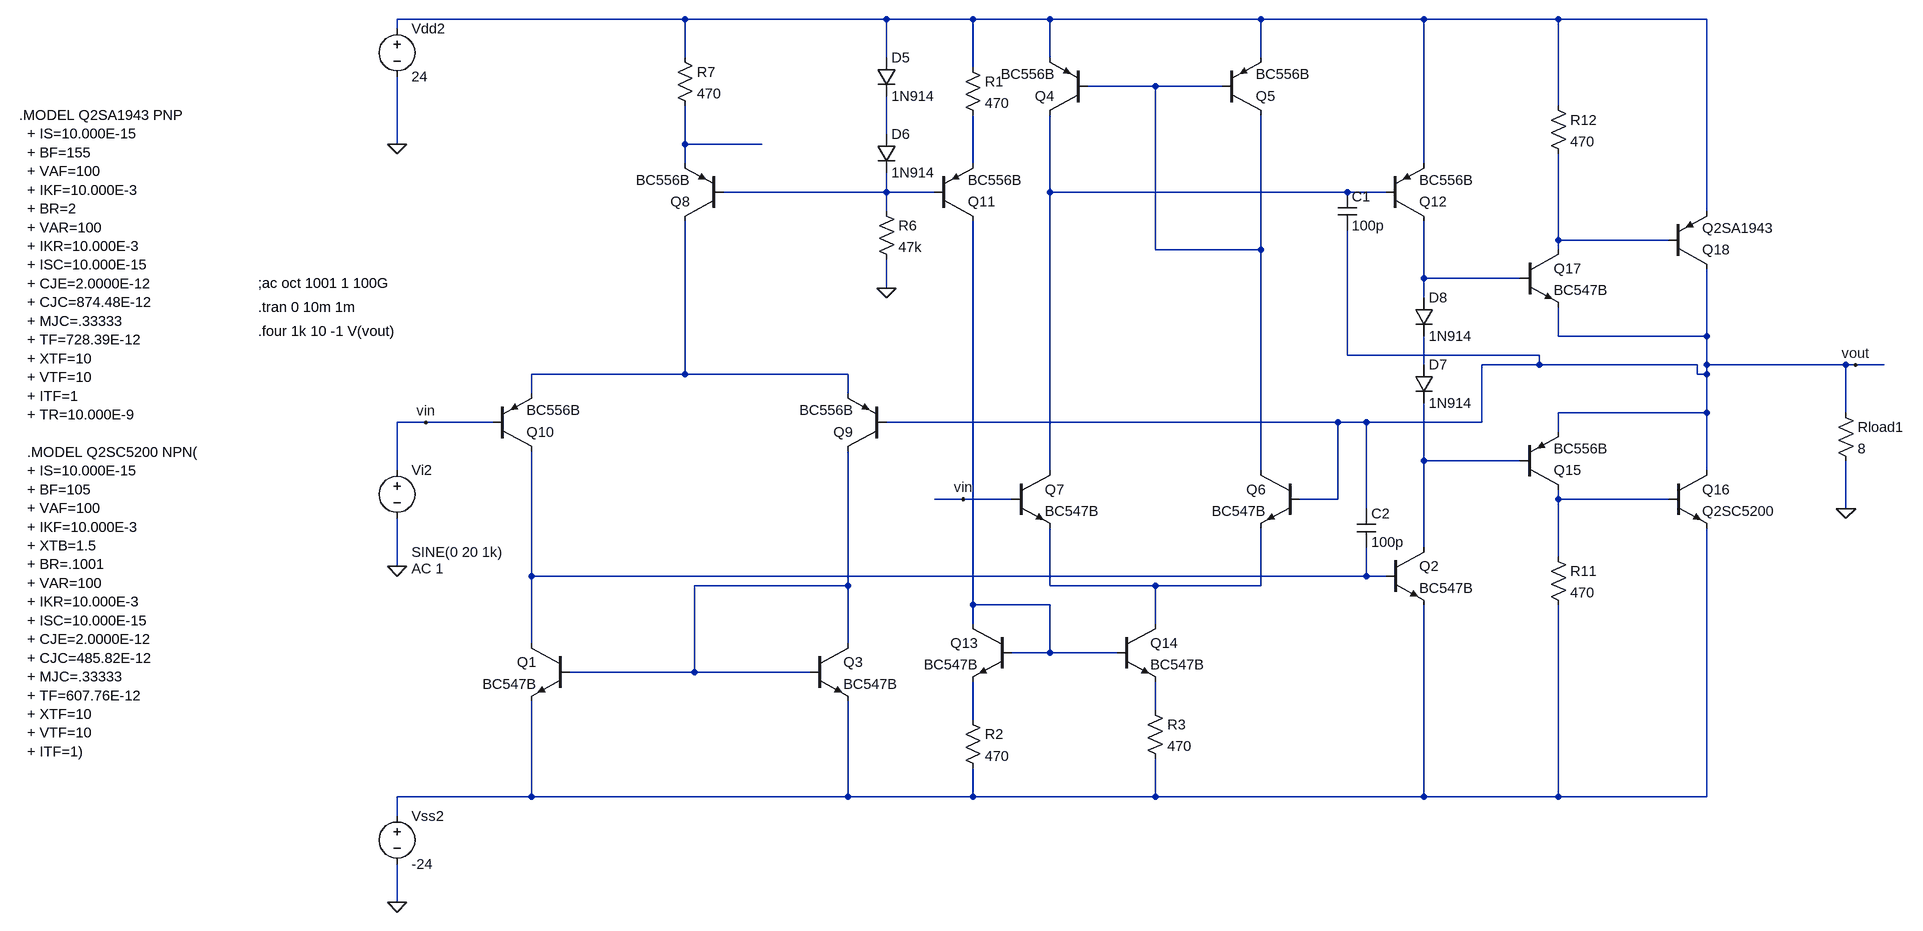
[diagram p0: schematic rail-to-rail-input-pair-amp.asc]
rail-to-rail-input-pair-amp.asc, the LTspice schematic file:
Version 4
SHEET 1 4780 1364
WIRE 2496 -128 2016 -128
WIRE 2832 -128 2496 -128
WIRE 2976 -128 2832 -128
WIRE 3104 -128 2976 -128
WIRE 3456 -128 3104 -128
WIRE 3728 -128 3456 -128
WIRE 3952 -128 3728 -128
WIRE 4208 -128 3952 -128
WIRE 2016 -112 2016 -128
WIRE 2496 -64 2496 -128
WIRE 2832 -64 2832 -128
WIRE 3104 -64 3104 -128
WIRE 3456 -64 3456 -128
WIRE 2976 -48 2976 -128
WIRE 3280 -16 3168 -16
WIRE 3392 -16 3280 -16
WIRE 3952 16 3952 -128
WIRE 2832 64 2832 0
WIRE 2016 80 2016 -32
WIRE 2496 80 2496 16
WIRE 2624 80 2496 80
WIRE 2496 112 2496 80
WIRE 2976 112 2976 32
WIRE 3728 112 3728 -128
WIRE 2832 160 2832 128
WIRE 2832 160 2560 160
WIRE 2912 160 2832 160
WIRE 3104 160 3104 32
WIRE 3600 160 3104 160
WIRE 3664 160 3600 160
WIRE 2832 192 2832 160
WIRE 4208 192 4208 -128
WIRE 3952 240 3952 96
WIRE 4144 240 3952 240
WIRE 3280 256 3280 -16
WIRE 3456 256 3456 32
WIRE 3456 256 3280 256
WIRE 3952 256 3952 240
WIRE 3728 304 3728 208
WIRE 3888 304 3728 304
WIRE 2832 320 2832 272
WIRE 3728 336 3728 304
WIRE 3952 400 3952 352
WIRE 4208 400 4208 288
WIRE 4208 400 3952 400
WIRE 3600 432 3600 224
WIRE 3920 432 3600 432
WIRE 3728 448 3728 400
WIRE 3920 448 3920 432
WIRE 3920 448 3824 448
WIRE 4192 448 3920 448
WIRE 4208 448 4208 400
WIRE 4528 448 4208 448
WIRE 4544 448 4528 448
WIRE 4592 448 4544 448
WIRE 2496 464 2496 208
WIRE 2496 464 2240 464
WIRE 2768 464 2496 464
WIRE 4192 464 4192 448
WIRE 4208 464 4208 448
WIRE 4208 464 4192 464
WIRE 2240 496 2240 464
WIRE 2768 496 2768 464
WIRE 4208 528 4208 464
WIRE 4208 528 3952 528
WIRE 4528 528 4528 448
WIRE 2064 544 2016 544
WIRE 2176 544 2064 544
WIRE 3584 544 2832 544
WIRE 3632 544 3584 544
WIRE 3824 544 3824 448
WIRE 3824 544 3632 544
WIRE 3952 560 3952 528
WIRE 3728 608 3728 512
WIRE 3888 608 3728 608
WIRE 2016 624 2016 544
WIRE 3104 624 3104 160
WIRE 3456 624 3456 256
WIRE 4208 624 4208 528
WIRE 2960 672 2912 672
WIRE 3040 672 2960 672
WIRE 3584 672 3584 544
WIRE 3584 672 3520 672
WIRE 3952 672 3952 656
WIRE 4144 672 3952 672
WIRE 3632 688 3632 544
WIRE 4528 688 4528 608
WIRE 3728 752 3728 608
WIRE 3952 768 3952 672
WIRE 2016 784 2016 704
WIRE 2240 800 2240 592
WIRE 3632 800 3632 752
WIRE 3632 800 2240 800
WIRE 3664 800 3632 800
WIRE 2768 816 2768 592
WIRE 2768 816 2512 816
WIRE 3104 816 3104 720
WIRE 3280 816 3104 816
WIRE 3456 816 3456 720
WIRE 3456 816 3280 816
WIRE 2976 848 2976 208
WIRE 3104 848 2976 848
WIRE 2976 880 2976 848
WIRE 3280 880 3280 816
WIRE 2240 912 2240 800
WIRE 2768 912 2768 816
WIRE 3104 928 3104 848
WIRE 3104 928 3040 928
WIRE 3216 928 3104 928
WIRE 2512 960 2512 816
WIRE 2512 960 2304 960
WIRE 2704 960 2512 960
WIRE 3280 1024 3280 976
WIRE 2976 1040 2976 976
WIRE 2240 1168 2240 1008
WIRE 2240 1168 2016 1168
WIRE 2768 1168 2768 1008
WIRE 2768 1168 2240 1168
WIRE 2976 1168 2976 1120
WIRE 2976 1168 2768 1168
WIRE 3280 1168 3280 1104
WIRE 3280 1168 2976 1168
WIRE 3728 1168 3728 848
WIRE 3728 1168 3280 1168
WIRE 3952 1168 3952 848
WIRE 3952 1168 3728 1168
WIRE 4208 1168 4208 720
WIRE 4208 1168 3952 1168
WIRE 2016 1200 2016 1168
WIRE 2016 1344 2016 1280
FLAG 2016 784 0
FLAG 2064 544 vin
FLAG 2016 1344 0
FLAG 2016 80 0
FLAG 2832 320 0
FLAG 4528 688 0
FLAG 4544 448 vout
FLAG 2960 672 vin
DATAFLAG 2624 464 ""
DATAFLAG 2608 80 ""
DATAFLAG 3440 544 ""
DATAFLAG 4048 240 ""
DATAFLAG 4064 672 ""
DATAFLAG 4592 448 ""
SYMBOL diode 2816 -64 R0
SYMATTR InstName D5
SYMATTR Value 1N914
SYMBOL diode 2816 64 R0
SYMATTR InstName D6
SYMATTR Value 1N914
SYMBOL res 2816 176 R0
SYMATTR InstName R6
SYMATTR Value 47k
SYMBOL pnp 2560 208 R180
SYMATTR InstName Q8
SYMATTR Value BC556B
SYMBOL res 2480 -80 R0
SYMATTR InstName R7
SYMATTR Value 470
SYMBOL pnp 2832 592 R180
SYMATTR InstName Q9
SYMATTR Value BC556B
SYMBOL pnp 2176 592 M180
SYMATTR InstName Q10
SYMATTR Value BC556B
SYMBOL voltage 2016 1184 R0
WINDOW 123 24 124 Left 2
WINDOW 39 0 0 Left 0
SYMATTR InstName Vss2
SYMATTR Value -24
SYMBOL voltage 2016 -128 R0
WINDOW 123 24 44 Left 2
WINDOW 39 0 0 Left 0
SYMATTR InstName Vdd2
SYMATTR Value 24
SYMBOL voltage 2016 608 R0
WINDOW 123 24 180 Left 2
WINDOW 39 0 0 Left 0
WINDOW 3 24 152 Left 2
SYMATTR Value2 AC 1
SYMATTR Value SINE(0 20 1k)
SYMATTR InstName Vi2
SYMBOL pnp 3664 208 M180
SYMATTR InstName Q12
SYMATTR Value BC556B
SYMBOL diode 3712 448 R0
SYMATTR InstName D7
SYMATTR Value 1N914
SYMBOL diode 3712 336 R0
SYMATTR InstName D8
SYMATTR Value 1N914
SYMBOL res 3936 752 R0
SYMATTR InstName R11
SYMATTR Value 470
SYMBOL res 3936 0 R0
SYMATTR InstName R12
SYMATTR Value 470
SYMBOL pnp 3888 656 M180
SYMATTR InstName Q15
SYMATTR Value BC556B
SYMBOL npn 4144 624 R0
SYMATTR InstName Q16
SYMATTR Value Q2SC5200
SYMBOL npn 3888 256 R0
SYMATTR InstName Q17
SYMATTR Value BC547B
SYMBOL pnp 4144 288 M180
SYMATTR InstName Q18
SYMATTR Value Q2SA1943
SYMBOL res 4512 512 R0
SYMATTR InstName Rload1
SYMATTR Value 8
SYMBOL npn 3664 752 R0
SYMATTR InstName Q2
SYMATTR Value BC547B
SYMBOL npn 2304 912 M0
SYMATTR InstName Q1
SYMATTR Value BC547B
SYMBOL npn 2704 912 R0
SYMATTR InstName Q3
SYMATTR Value BC547B
SYMBOL npn 3520 624 M0
SYMATTR InstName Q6
SYMATTR Value BC547B
SYMBOL npn 3040 624 R0
SYMATTR InstName Q7
SYMATTR Value BC547B
SYMBOL pnp 3168 32 R180
SYMATTR InstName Q4
SYMATTR Value BC556B
SYMBOL pnp 3392 32 M180
SYMATTR InstName Q5
SYMATTR Value BC556B
SYMBOL pnp 2912 208 M180
SYMATTR InstName Q11
SYMATTR Value BC556B
SYMBOL npn 3040 880 M0
SYMATTR InstName Q13
SYMATTR Value BC547B
SYMBOL npn 3216 880 R0
SYMATTR InstName Q14
SYMATTR Value BC547B
SYMBOL res 2960 -64 R0
SYMATTR InstName R1
SYMATTR Value 470
SYMBOL res 2960 1024 R0
SYMATTR InstName R2
SYMATTR Value 470
SYMBOL res 3264 1008 R0
SYMATTR InstName R3
SYMATTR Value 470
SYMBOL cap 3584 160 R0
SYMATTR InstName C1
SYMATTR Value 100p
SYMBOL cap 3616 688 R0
SYMATTR InstName C2
SYMATTR Value 100p
TEXT 1256 32 Left 2 !.MODEL Q2SA1943 PNP\n  + IS=10.000E-15\n  + BF=155\n  + VAF=100\n  + IKF=10.000E-3\n  + BR=2\n  + VAR=100\n  + IKR=10.000E-3\n  + ISC=10.000E-15\n  + CJE=2.0000E-12\n  + CJC=874.48E-12\n  + MJC=.33333\n  + TF=728.39E-12\n  + XTF=10\n  + VTF=10\n  + ITF=1\n  + TR=10.000E-9\n \n  .MODEL Q2SC5200 NPN(\n  + IS=10.000E-15\n  + BF=105\n  + VAF=100\n  + IKF=10.000E-3\n  + XTB=1.5\n  + BR=.1001\n  + VAR=100\n  + IKR=10.000E-3\n  + ISC=10.000E-15\n  + CJE=2.0000E-12\n  + CJC=485.82E-12\n  + MJC=.33333\n  + TF=607.76E-12\n  + XTF=10\n  + VTF=10\n  + ITF=1)
TEXT 1784 312 Left 2 !;ac oct 1001 1 100G
TEXT 1784 352 Left 2 !.tran 0 10m 1m
TEXT 1784 392 Left 2 !.four 1k 10 -1 V(vout)

The netlist it stands for:
* rail-to-rail-input-pair-amp.asc
D5 N001 N003 1N914
D6 N003 N006 1N914
R6 N006 0 47k
Q8 N011 N006 N004 0 BC556B
R7 N001 N004 470
Q9 N015 vout N011 0 BC556B
Q10 N014 vin N011 0 BC556B
Vss2 N020 0 -24
Vdd2 N001 0 24
Vi2 vin 0 SINE(0 20 1k) AC 1
Q12 N009 N007 N001 0 BC556B
D7 N010 N012 1N914
D8 N009 N010 1N914
R11 N013 N020 470
R12 N001 N008 470
Q15 N013 N012 vout 0 BC556B
Q16 vout N013 N020 0 Q2SC5200
Q17 N008 N009 vout 0 BC547B
Q18 vout N008 N001 0 Q2SA1943
Rload1 vout 0 8
Q2 N012 N014 N020 0 BC547B
Q1 N014 N015 N020 0 BC547B
Q3 N015 N015 N020 0 BC547B
Q6 N002 vout N016 0 BC547B
Q7 N007 vin N016 0 BC547B
Q4 N007 N002 N001 0 BC556B
Q5 N002 N002 N001 0 BC556B
Q11 N017 N006 N005 0 BC556B
Q13 N017 N017 N019 0 BC547B
Q14 N016 N017 N018 0 BC547B
R1 N001 N005 470
R2 N019 N020 470
R3 N018 N020 470
C1 N007 vout 100p
C2 vout N014 100p
.model D D
.lib standard.dio
.model NPN NPN
.model PNP PNP
.lib standard.bjt
.MODEL Q2SA1943 PNP
  + IS=10.000E-15
  + BF=155
  + VAF=100
  + IKF=10.000E-3
  + BR=2
  + VAR=100
  + IKR=10.000E-3
  + ISC=10.000E-15
  + CJE=2.0000E-12
  + CJC=874.48E-12
  + MJC=.33333
  + TF=728.39E-12
  + XTF=10
  + VTF=10
  + ITF=1
  + TR=10.000E-9
  .MODEL Q2SC5200 NPN(
  + IS=10.000E-15
  + BF=105
  + VAF=100
  + IKF=10.000E-3
  + XTB=1.5
  + BR=.1001
  + VAR=100
  + IKR=10.000E-3
  + ISC=10.000E-15
  + CJE=2.0000E-12
  + CJC=485.82E-12
  + MJC=.33333
  + TF=607.76E-12
  + XTF=10
  + VTF=10
  + ITF=1)
;ac oct 1001 1 100G
.tran 0 10m 1m
.four 1k 10 -1 V(vout)
.backanno
.end